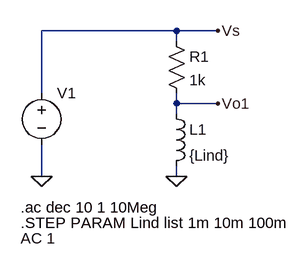
[diagram p0: schematic AcAnalysis.asc]
AcAnalysis.asc, the LTspice schematic file:
Version 4
SHEET 1 880 680
WIRE 288 -16 80 -16
WIRE 352 -16 288 -16
WIRE 288 0 288 -16
WIRE 80 80 80 -16
WIRE 288 96 288 80
WIRE 352 96 288 96
WIRE 288 112 288 96
WIRE 80 208 80 160
WIRE 288 208 288 192
FLAG 288 208 0
FLAG 80 208 0
FLAG 352 -16 Vs
FLAG 352 96 Vo1
SYMBOL voltage 80 64 R0
WINDOW 3 -32 191 Left 2
WINDOW 123 -32 240 Left 2
WINDOW 39 0 0 Left 0
SYMATTR Value ""
SYMATTR InstName V1
SYMATTR Value2 AC 1
SYMBOL res 272 -16 R0
SYMATTR InstName R1
SYMATTR Value 1k
SYMBOL ind 272 96 R0
SYMATTR InstName L1
SYMATTR Value {Lind}
TEXT 48 256 Left 2 !.ac dec 10 1 10Meg
TEXT 48 280 Left 2 !.STEP PARAM Lind list 1m 10m 100m

The netlist it stands for:
* AcAnalysis.asc
V1 Vs 0 AC 1
R1 Vs Vo1 1k
L1 Vo1 0 {Lind}
.ac dec 10 1 10Meg
.STEP PARAM Lind list 1m 10m 100m
.backanno
.end